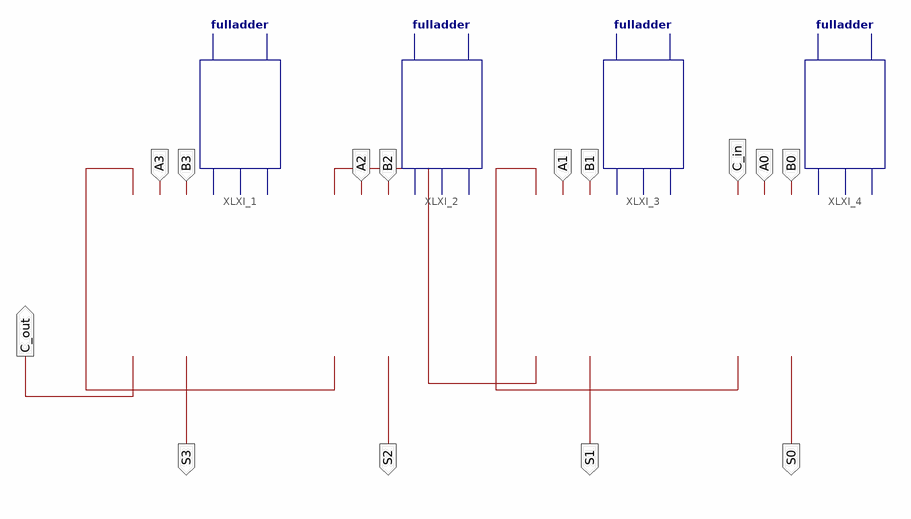
[diagram p0: schematic sheet 1]
// Xilinx ISE schematic fourbitadder.sch (spartan3) as structural Verilog: 4 symbols, 14 ports
module fourbitadder (
  input  A3,
  input  B3,
  input  A1,
  input  B1,
  input  B2,
  input  A2,
  input  C_in,
  input  A0,
  input  B0,
  output C_out,
  output S3,
  output S2,
  output S1,
  output S0
);

  wire XLXN_1, XLXN_2, XLXN_3;

  fulladder XLXI_1 (.C_in(XLXN_3), .A(A3), .B(B3), .C_out(C_out), .S(S3));
  fulladder XLXI_2 (.C_in(XLXN_2), .A(A2), .B(B2), .C_out(XLXN_3), .S(S2));
  fulladder XLXI_3 (.C_in(XLXN_1), .A(A1), .B(B1), .C_out(XLXN_2), .S(S1));
  fulladder XLXI_4 (.C_in(C_in), .A(A0), .B(B0), .C_out(XLXN_1), .S(S0));
endmodule
